# EAGLE design CAN-Breakout2021_neu_02 (EAGLE 9.6.2)
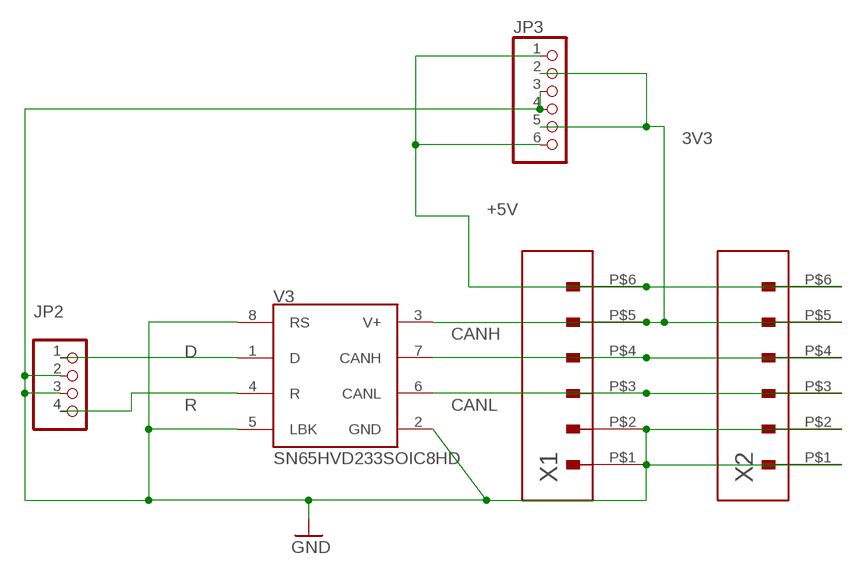
[diagram p0: schematic, sheet 1]

## Parts
JP2  PINHD-1X4  [1X04]
JP3  PINHD-1X6  [1X06]
V3  SN65HVD233SOIC8HD  [SO08]
X1  MOLEX104078-0610  [MOLEX104078-0610]
X2  MOLEX104078-0610  [MOLEX104078-0610]

## Nets
3V3: JP3.2 JP3.5 V3.3(V+) X1.P$5 X2.P$5
+5V: JP3.1 JP3.6 X1.P$6 X2.P$6
CANH: V3.7(CANH) X1.P$4 X2.P$4
CANL: V3.6(CANL) X1.P$3 X2.P$3
D: JP2.1 V3.1(D)
GND: JP2.2 JP2.3 JP3.3 JP3.4 V3.2(GND) V3.5(LBK) V3.8(RS) X1.P$1 X1.P$2 X2.P$1 X2.P$2
R: JP2.4 V3.4(R)

## Library data of the parts
JP2 = pinhead:PINHD-1X4: PIN HEADER
JP3 = pinhead:PINHD-1X6: PIN HEADER
V3 = Treiber:SN65HVD233: CAN Transceiver, 3,3V
X1 X2 = Roboter:MOLEX104078-0610

## Board
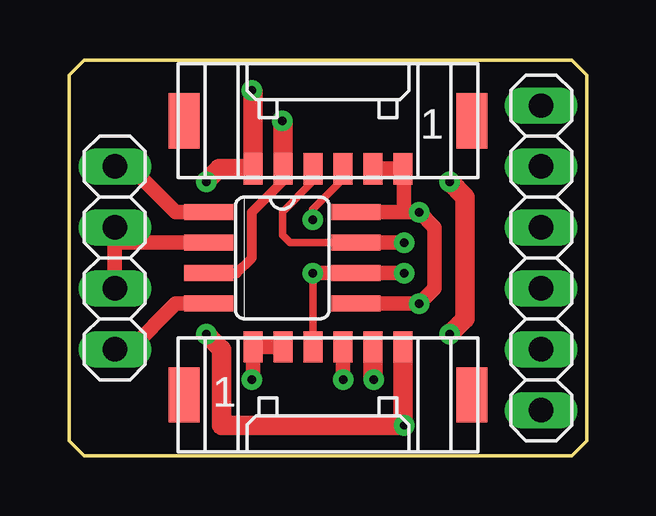
[diagram p1: board, top side]
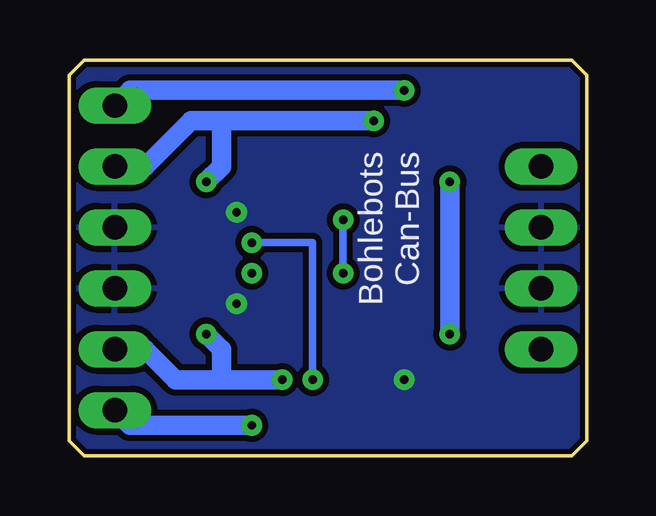
[diagram p2: board, bottom side, seen from below]

Size 21.59 x 16.51 mm. Coordinates in mm from the lower left corner, seen from the top.
Outline: 0,15.88 0,0.64 0.63,0 20.95,0 21.59,0.64 21.59,15.88 20.95,16.51 0.63,16.51 0,15.88
Copper layers (1*16): Top 0.035mm / dielectric 1.5mm / Bottom 0.035mm
Design rules "default *": minimum track width 10mil, minimum drill 8mil, track to track 10mil, track to pad 10mil, pad to pad 10mil, via to via 10mil, smd to smd 10mil, copper to edge 8mil, drill to drill 8mil, minimum pad ring 10mil, minimum via ring 10mil, stop-mask expansion 0mil, vias tented up to drill 0mil, thermal gap 10mil

### Footprints (pad centres in the part's own frame; a part is rotated, then mirrored left to right if it is on the bottom)
1X04 = drill 1.016 long: 1 -3.81,0; 2 -1.27,0; 3 1.27,0; 4 3.81,0
1X06 = drill 1.016 long: 1 -6.35,0; 2 -3.81,0; 3 -1.27,0; 4 1.27,0; 5 3.81,0; 6 6.35,0
SO08 = smd 0.66 x 2.032: 1 -1.905,-3.073; 2 -0.635,-3.073; 3 0.635,-3.073; 4 1.905,-3.073; 5 1.905,3.073; 6 0.635,3.073; 7 -0.635,3.073; 8 -1.905,3.073
MOLEX104078-0610 = smd 0.8 x 1.3: P$1 -3.125,2; P$2 -1.875,2; P$3 -0.625,2; P$4 0.625,2; P$5 1.875,2; P$6 3.125,2 | smd 1.3 x 2.3: P$7 -6,0; P$8 6,0

### Placement (x,y rotation side)
JP2  1.9,8.26 270 top
JP3  19.69,8.26 90 top
V3  8.89,8.26 270 top
X1  10.79,13.97 180 top
X2  10.79,2.54 0 top

### Tracks (layer width: path | path; a pad name or v marks a point on that pad's centre or on a via)
3V3  (via drill 0.35)
  Top 0.406: V3.3 6.98,7.62 7.62,8.26 7.62,10.16 8.92,11.46 X1.P$5
  Top 0.813: v12.7,3.18 12.67,3.21 X2.P$5 | v8.89,13.97 8.92,13.94 X1.P$5 | v15.88,5.08 16.51,5.72 16.51,10.8 v15.88,11.43
  Bottom 0.813: JP3.5 18.41,12.07 16.51,13.97 15.24,13.97 | 15.24,13.97 v8.89,13.97 | JP3.2 18.41,4.45 17.14,3.18 15.24,3.18 | 15.24,3.18 v12.7,3.18 | 15.24,3.18 15.24,4.45 v15.88,5.08 | v15.88,11.43 15.24,12.07 15.24,13.97
+5V  (via drill 0.35)
  Top 0.813: X2.P$6 13.92,1.32 v13.97,1.27 6.35,1.27 6.35,4.45 v5.71,5.08 | v7.62,15.24 7.67,15.19 X1.P$6 6.25,11.97 v5.71,11.43
  Bottom 0.813: JP3.1 19.05,1.27 v13.97,1.27 | JP3.6 19.05,15.24 v7.62,15.24 | v5.71,11.43 v5.71,5.08
CANH  (via drill 0.35)
  Top 0.305: X1.P$4 10.16,11.96 10.16,11.43 8.89,10.16 8.89,9.21 9.21,8.89 V3.7
  Top 0.61: V3.7 v13.97,8.89 | v11.43,3.18 11.42,3.19 X2.P$4
  Bottom 0.305: v13.97,8.89 11.43,8.89 v11.43,3.18
CANL  (via drill 0.35)
  Top 0.305: X2.P$3 10.17,7.61 | v10.16,9.84 10.16,10.28 11.42,11.54 X1.P$3
  Top 0.61: 10.17,7.61 v10.16,7.62 V3.6 v13.97,7.62
  Bottom 0.305: v10.16,9.84 v10.16,7.62
D
  Top 0.61: V3.1 4.45,10.16 2.54,12.07 JP2.1
GND  (via drill 0.35)
  Top 0.61: V3.2 1.9,8.89 JP2.2 JP2.3 | X1.P$2 X1.P$1 13.97,11.92 13.97,10.16 | X2.P$2 X2.P$1 7.67,3.23 v7.62,3.18 | V3.8 13.97,10.16 | V3.5 v14.61,6.35 15.24,6.99 15.24,9.53 v14.61,10.16 13.97,10.16
  pour Bottom: 22.23,17.78 22.86,17.15 22.86,-0.63 22.23,-1.27 -0.63,-1.27 -1.27,-0.63 -1.27,17.15 -0.63,17.78
R
  Top 0.61: V3.4 4.45,6.35 2.54,4.45 JP2.4

### Text on the board
bNames: Bohlebots / Can-Bus